# EAGLE design HM-MYS_relay_board_v1.0 (EAGLE 6.6.0)
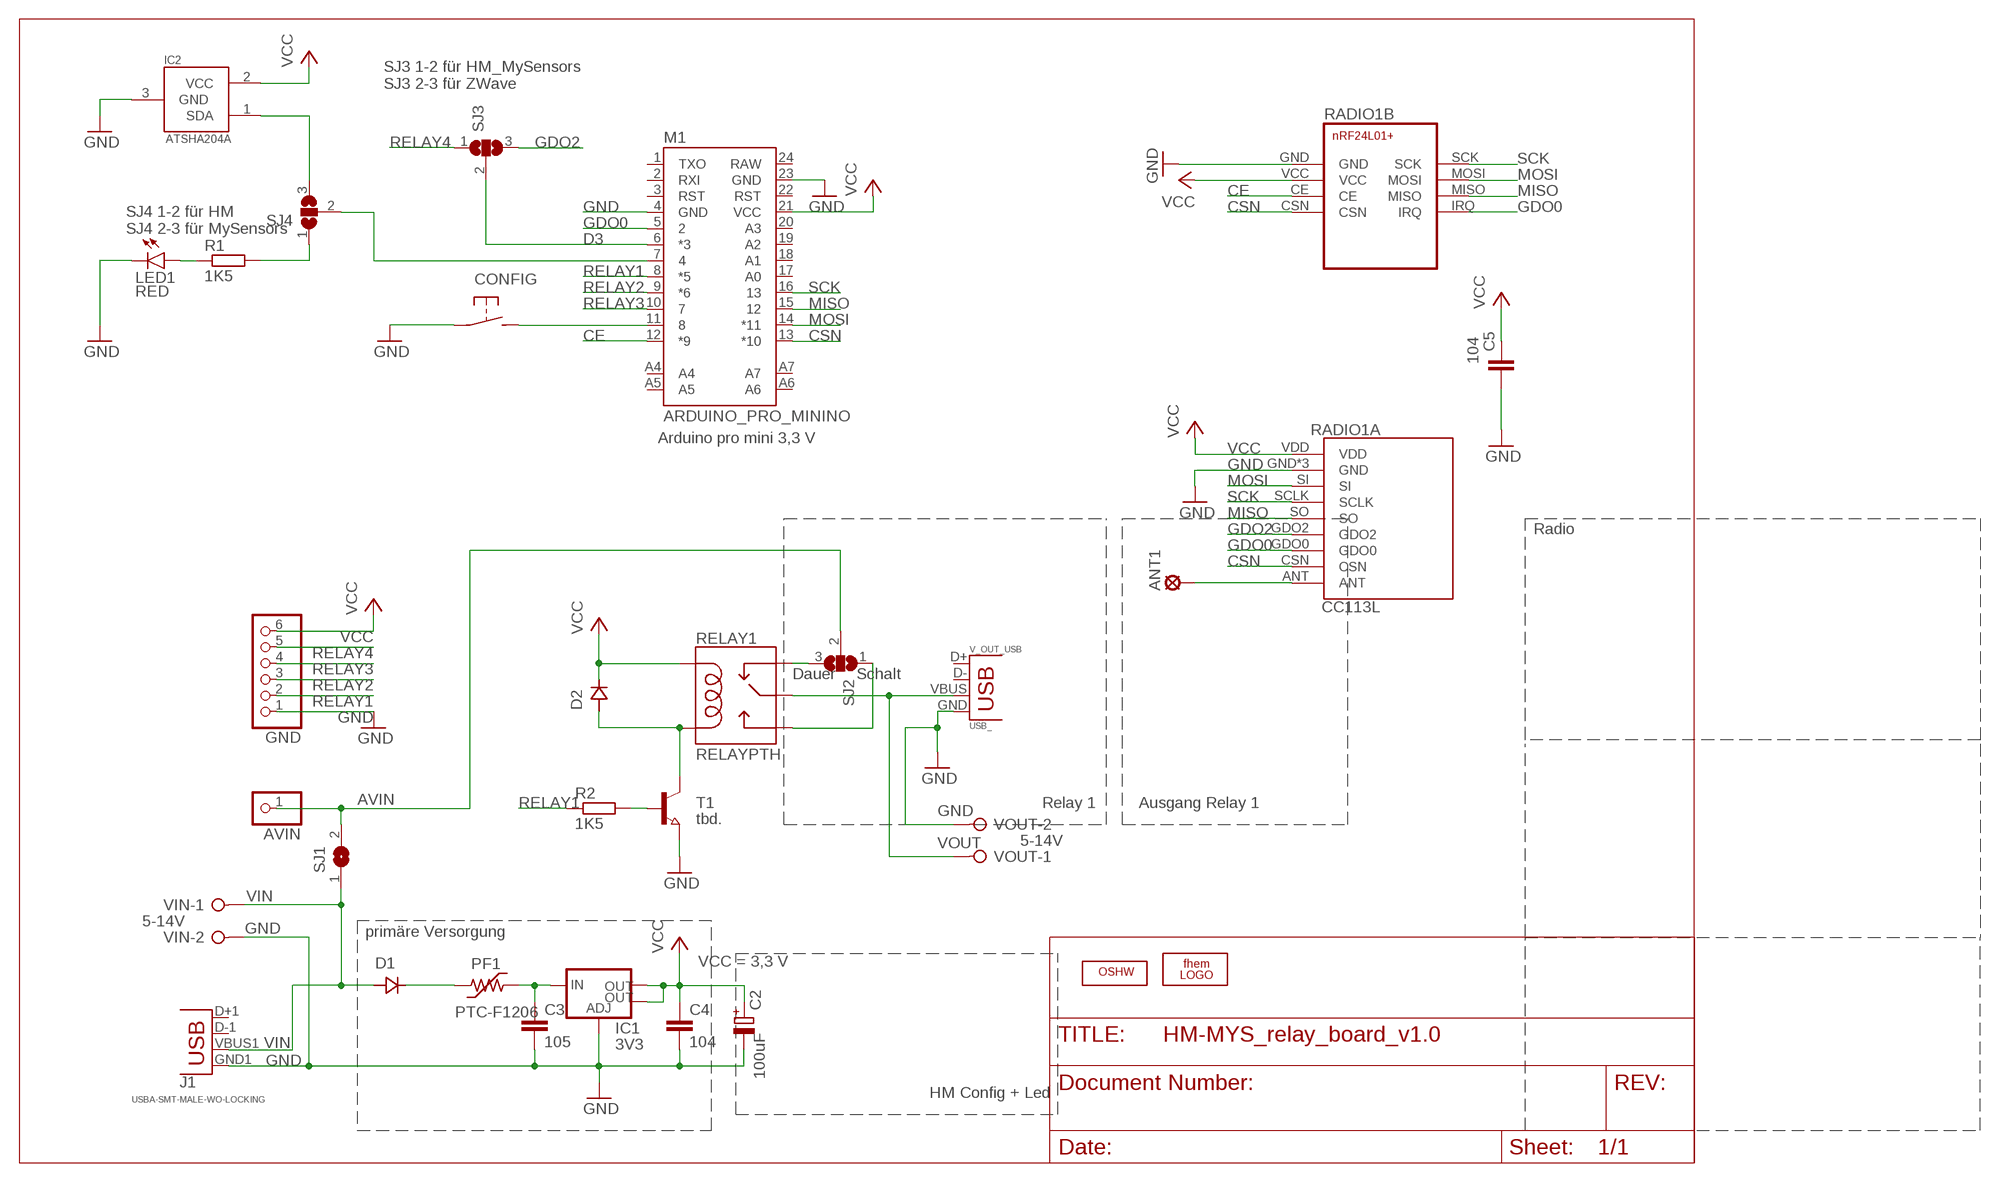
[diagram p0: schematic, sheet 1]

## Parts
ANT1  LSP10  [LSP10]
AVIN  PINHD-1X1  [1X01]
C2  100uF  CPOL-EUE2,5-6E  [E2,5-6E]
C3  105  C-EUC0805  [C0805]
C4  104  C-EUC0805  [C0805]
C5  104  C-EUC0805  [C0805]
CONFIG  TASTERSMD  [TASTER-SMD]
D1  SS14  [DO214]
D2  SS14  [DO214]
GND  PINHD-1X6_S  [1X06]
IC1  3V3  V_REG_LM1117SOT223  [SOT223]
IC2  ATSHA204A  IC_ATSHA204A_CRYPT  [SOT23-3]
J1  USBA-SMT-MALE-WO-LOCKING  [USB-A-SMT-MALE-NO_LOCKING]
LED1  RED  LED-RED1206  [LED-1206]
LOGO2  LOGO_OSHWX0070  [OSHW_6X70]
M1  ARDUINO_PRO_MININO  [ARDUINO_PRO_MINI_O]
PF1  PTC-F1206  [F1206]
R1  1K5  R0805_SMALL_GAP  [R0805_SMALL_GAP]
R2  1K5  R0805_SMALL_GAP  [R0805_SMALL_GAP]
RADIO1A  CC113L  [CC113L]
RADIO1B  NRF24L01+NRF24L01+MINI  [NRF24L01+MINI]
RELAY1  RELAYPTH  [SRD-05VDC-SL-C]
SJ1  SJ  [SJ]
SJ2  SJ2W  [SJ_2]
SJ3  SJ2W  [SJ_2]
SJ4  SJ2W  [SJ_2]
T1  tbd.  NPN-TRANSISTOR_SOT89  [SOT89]
U$2  LOGO_FHEMSTOP  [LOGO_FHEM_3X3_STOP]
V_OUT_USB  USB_  [USB-A-S-SILK-FEMALE]
VIN  W237-02P  [W237-132]
VOUT  W237-02P  [W237-132]

## Nets
ATSHA: IC2.1(SDA) SJ4.3
AVIN: AVIN.1 SJ1.2 SJ2.2
CE: M1.12(*9) RADIO1B.CE
CSN: M1.13(*10) RADIO1A.CSN RADIO1B.CSN
D3: M1.6(*3) SJ3.2
D4: M1.7 SJ4.2
DAUER: RELAY1.SWCLOSED(SWCLOSE) SJ2.3
GDO0: M1.5 RADIO1A.GDO0 RADIO1B.IRQ
GDO2: RADIO1A.GDO2 SJ3.3
GND: C2.- C3.2 C4.2 C5.2 CONFIG.1(P) GND.1 IC1.1(ADJ) IC2.3(GND) J1.GND1(GND) LED1.C M1.4(GND) M1.23(GND) RADIO1A.GND RADIO1A.GND1(GND) RADIO1A.GND2(GND) RADIO1B.GND T1.3(E) V_OUT_USB.GND VIN.2 VOUT.2
LED: R1.2 SJ4.1
MISO: M1.15 RADIO1A.SO RADIO1B.MISO
MOSI: M1.14(*11) RADIO1A.SI RADIO1B.MOSI
N$1: CONFIG.2(S) M1.11
N$3: LED1.A R1.1
N$11: ANT1.1(MP) RADIO1A.ANT
N$13: D2.ANODE RELAY1.COIL0 T1.2(C)
N$16: R2.2 T1.1(B)
RELAY1: GND.2 M1.8(*5) R2.1
RELAY2: GND.3 M1.9(*6)
RELAY3: GND.4 M1.10
RELAY4: GND.5 SJ3.1
SCHALT: RELAY1.SWOPEN SJ2.1
SCK: M1.16 RADIO1A.SCLK RADIO1B.SCK
VCC: C2.+ C4.1 C5.1 D2.CATHODE GND.6 IC1.2(OUT) IC1.4(OUT) IC2.2(VCC) M1.21(VCC) RADIO1A.VDD RADIO1B.VCC RELAY1.COIL1
VIN: D1.ANODE J1.VBUS1(VBUS) SJ1.1 VIN.1
VOUT: RELAY1.SWCOMMON V_OUT_USB.VBUS VOUT.1
VREG_IN: C3.1 IC1.3(IN) PF1.2
VUSB: D1.CATHODE PF1.1
Unconnected: J1.D+1(D+) J1.D-1(D-) M1.1(TXO) M1.2(RXI) M1.3(RST) M1.17(A0) M1.18(A1) M1.19(A2) M1.20(A3) M1.22(RST) M1.24(RAW) M1.A4 M1.A5 M1.A6 M1.A7 V_OUT_USB.D+ V_OUT_USB.D-

## Notes on the sheet
- SJ3 1-2 für HM_MySensors
  SJ3 2-3 für ZWave
- SJ4 1-2 für HM
  SJ4 2-3 für MySensors
- Arduino pro mini 3,3 V
- Radio
- Dauer | Schalt
- Relay 1 | Ausgang Relay 1
- 5-14V
- 5-14V
- primäre Versorgung
- VCC = 3,3 V
- HM Config + Led

## Library data of the parts
ANT1 = Hexenmeister:LSP10: SOLDER PAD drill 1.0 mm, distributor Buerklin, 12H555
AVIN = pinhead:PINHD-1X1: PIN HEADER
C2 = rcl:CPOL-EU: POLARIZED CAPACITOR, European symbol
C3-C5 = resistor:C-EU: CAPACITOR, European symbol
CONFIG = Damian:TASTER: Microtaster
D1 D2 = ihpcb-diode:SS14
GND = Hexenmeister:PINHD-1X6_S: PIN HEADER
IC1 = SparkFun-PowerIC:V_REG_LM1117: Voltage Regulator LM1117 Standard adjustable voltage regulator but in SMD form. Spark Fun Electronics SKU : COM-00595; PROD_ID: VREG-08170
IC2 = MySensors:IC_ATSHA204A_CRYPT
J1 V_OUT_USB = SparkFun-Connectors:USB: USB Connectors USB-B-PTH is fully proven SKU : PRT-00139/CONN-08278 USB-miniB is fully proven SKU : PRT-00587 USB-A-PCB is untested. USB-A-H is throughly reviewed, but untested. Spark Fun Electronics SKU : PRT-00437 USB-B-SMT is throughly reviewed, but untested. Needs silkscreen touching up. USB-A-S has not been used/tested USB-MB-H has not been used/tested USB-MICROB has been used. CONN-09505
LED1 = SparkFun-LED:LED-RED: Assorted Red LEDs LilyPad 1206- DIO-09912 1206- DIO-00809 0603- DIO-00819 "SMART" means more efficient and expensive; PROD_ID: DIO-09912
LOGO2 = mechanics:LOGO_OSHW: Open-Source-Hardware Logo
M1 = Hexenmeister:ARDUINO_PRO_MINI
PF1 = polyswitch:PTC-: POLYSWITCH Polyswitch Resetable Fuses
R1 R2 = Hexenmeister:R0805_SMALL_GAP: SMD Resistor (0805) mit einer schmalleren Lücke (kann als Lötjumper erwendet werden)
RADIO1A = Damian:CC113L: CC113L Value Line Receiver Module CC1101 replacement module Source: http://www.ti.com/product/cc113l
RADIO1B = my:NRF24L01+: nRF24L01+ Transceiver Module
RELAY1 = SRD-05VDC-SL-C:RELAY: SPDT relay (COM-00101)
SJ1 = jumper:SJ: SMD solder JUMPER
SJ2-SJ4 = jumper:SJ2W: SMD solder JUMPER
T1 = semicon-smd-ipc:NPN-TRANSISTOR_: NPN TRANSISTOR
U$2 = logo:LOGO_FHEM: fhem logo for PCB
VIN VOUT = Hexenmeister:W237-02P: WAGO SREW CLAMP; OC_FARNELL: unknown; OC_NEWARK: unknown

## Board
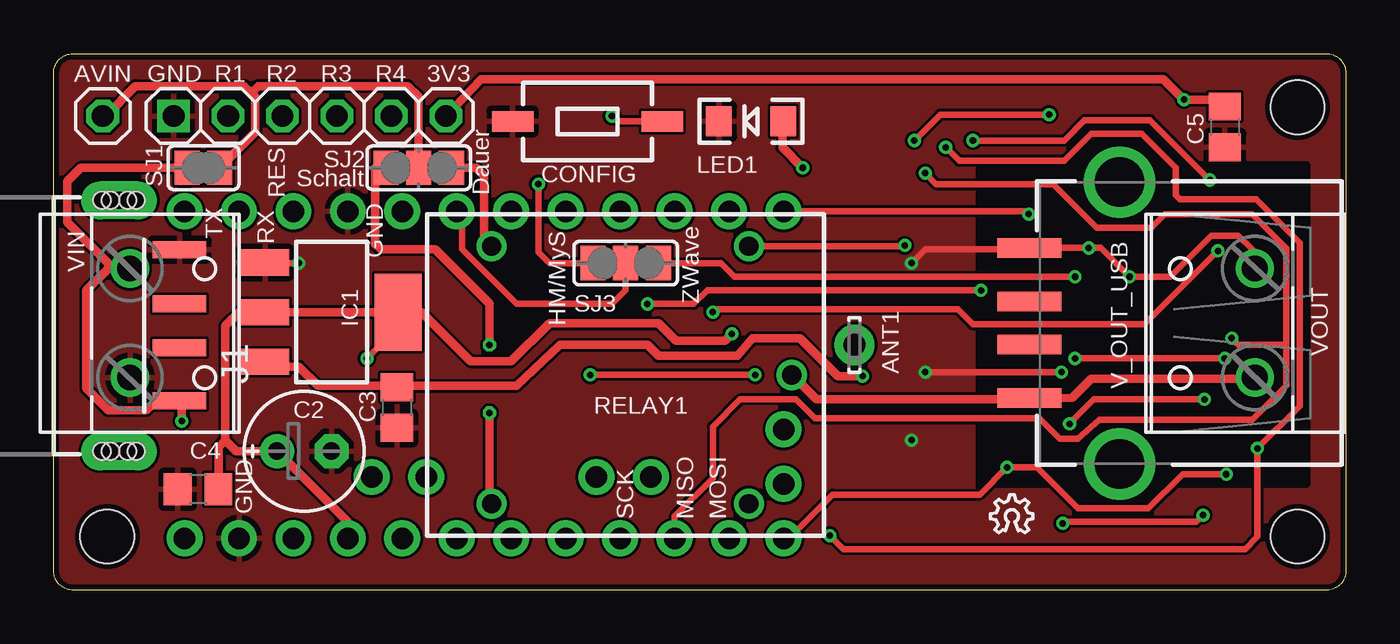
[diagram p1: board, top side]
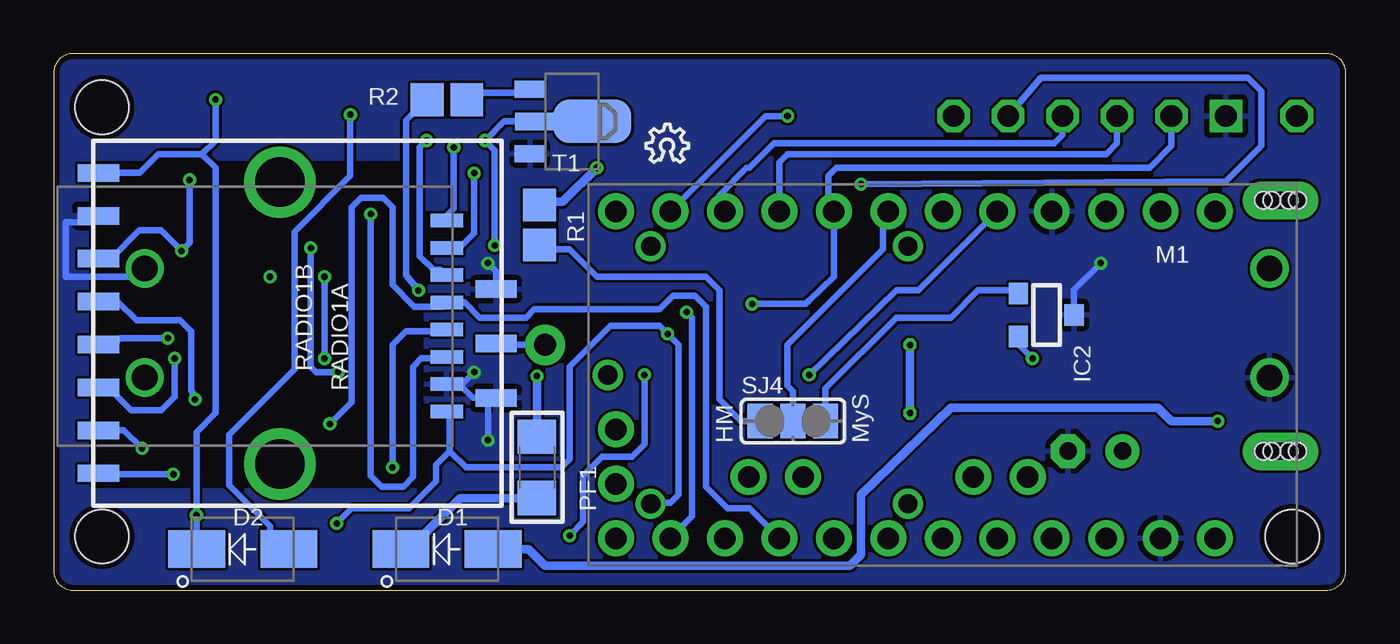
[diagram p2: board, bottom side, seen from below]

Size 60.26 x 25.01 mm. Coordinates in mm from the lower left corner, seen from the top.
Outline: 0.01,0.81 0.01,24.01 arc-90 0.81,25.01 59.26,25.01 arc-90 60.26,24.21 60.26,1.01 arc-90 59.46,0.01 1.01,0.01 arc-90 0.01,0.81
Copper layers (1*16): Top 0.035mm / dielectric 1.5mm / Bottom 0.035mm
Design rules "dirtypcbs_v1.0": minimum track width 5mil, minimum drill 12mil, track to track 5mil, track to pad 5mil, pad to pad 5mil, via to via 5mil, smd to smd 0mil, copper to edge 10mil, drill to drill 10mil, minimum pad ring 10mil, minimum via ring 6mil, stop-mask expansion 2mil, vias tented up to drill 25mil, thermal gap 10mil
Holes 2.5 mm at 2.51,2.51 58.01,2.51 58.01,22.51

### Footprints (pad centres in the part's own frame; a part is rotated, then mirrored left to right if it is on the bottom)
LSP10 = drill 1.016 pad 1.88: 1 0,0
1X01 = drill 1.016 octagon: 1 0,0
E2,5-6E = drill 0.813 pad 1.575: + -1.27,0 | drill 0.813 pad 1.575 octagon: - 1.27,0
C0805 = smd 1.3 x 1.5: 1 -0.95,0; 2 0.95,0
TASTER-SMD = smd 1.93 x 0.965: 1 -3.493,0; 2 3.493,0
DO214 = smd 2.65 x 1.75: ANODE -2.15,0; CATHODE 2.15,0
1X06 = drill 1.016 square: 1 -6.35,0 | drill 1.016 octagon: 2 -3.81,0; 3 -1.27,0; 4 1.27,0; 5 3.81,0; 6 6.35,0
SOT223 = smd 1.219 x 2.235: 1 -2.311,-3.099; 2 0,-3.099; 3 2.311,-3.099 | smd 3.6 x 2.2: 4 0,3.099
SOT23-3 = smd 1 x 0.9: 1 -1,-1.3; 2 1,-1.3; 3 0,1.3
USB-A-SMT-MALE-NO_LOCKING = smd 0.8 x 2.5: D+1 1.027,-5.87; D-1 -1.027,-5.87; GND1 3.551,-5.87; VBUS1 -3.5,-5.87 | drill 0.8 pad 1.778 long: P$1 5.85,-3.05; P$3 -5.85,-3.05 | hole 0.8: -5.85,-3.45; -5.85,-3.85; -5.85,-2.65; -5.85,-2.25; 5.85,-3.45; 5.85,-3.85; 5.85,-2.65; 5.85,-2.25
LED-1206 = smd 1.2 x 1.4: A -1.5,0; C 1.5,0
ARDUINO_PRO_MINI_O = drill 1 pad 1.676: 1 -7.62,12.7; 2 -7.62,10.16; 3 -7.62,7.62; 4 -7.62,5.08; 5 -7.62,2.54; 6 -7.62,0; 7 -7.62,-2.54; 8 -7.62,-5.08; 9 -7.62,-7.62; 10 -7.62,-10.16; 11 -7.62,-12.7; 12 -7.62,-15.24; 13 7.62,-15.24; 14 7.62,-12.7; 15 7.62,-10.16; 16 7.62,-7.62; 17 7.62,-5.08; 18 7.62,-2.54; 19 7.62,0; 20 7.62,2.54; 21 7.62,5.08; 22 7.62,7.62; 23 7.62,10.16; 24 7.62,12.7; A4 4.763,1.429; A5 4.763,3.969; A6 4.763,-9.049; A6@1 2.54,-15.24; A7 4.763,-6.509; A7@1 5.08,-15.24
F1206 = smd 1.6 x 1.803: 1 -1.429,0; 2 1.429,0
R0805_SMALL_GAP = smd 1.524 x 1.524: 1 -0.927,0; 2 0.927,0
CC113L = smd 0.813 x 1.93: ANT 0.953,9.271; CSN 7,-9.271; GDO0 5,-9.271; GDO2 3,-9.271; GND -5,-9.271; GND1 -1.587,9.271; GND2 3.493,9.271; SCLK -1,-9.271; SI -3,-9.271; SO 1,-9.271; VDD -7,-9.271
NRF24L01+MINI = smd 0.635 x 1.524: CE -1.575,-7.861; CSN -0.305,-7.861; GND -2.845,-7.861; IRQ 4.775,-7.861; MISO 3.505,-7.861; MOSI 2.235,-7.861; SCK 0.965,-7.861; VCC -4.115,-7.861
SRD-05VDC-SL-C = drill 0.9: COIL0 -5.39,-6.12; COIL1 -5.39,5.88; SWCLOSED 6.61,-6.12; SWCOMMON -7.39,-0.12; SWOPEN 6.61,5.88
SJ = smd 1.168 x 1.6: 1 -0.762,0; 2 0.762,0
SJ_2 = smd 1.168 x 1.6: 1 -1.524,0; 2 0,0; 3 1.524,0
SOT89 = smd 0.8 x 1.4: 1 -1.499,-1.981; 3 1.499,-1.981 | smd 0.8 x 1.9: 2 0,-1.727 | smd 2.032 x 3.65: 2@1 0,0.94
USB-A-S-SILK-FEMALE = smd 3 x 0.9: D+ 7.212,-1; D- 7.212,1; GND 7.212,-3.5; VBUS 7.212,3.5 | drill 2.311: P$5 3,-6.566; P$6 3,6.566
W237-132 = drill 1.194: 1 -2.54,-0.635; 2 2.54,-0.635

### Placement (x,y rotation side)
ANT1  37.34,11.44 90 top
AVIN  2.29,22.1 0 top
C2  11.69,6.48 0 top
C3  16.01,8.51 270 top
C4  6.74,4.7 180 top
C5  54.62,21.6 270 top
CONFIG  24.9,21.85 0 top
D1  41.92,1.91 180 bottom
D2  51.44,1.91 180 bottom
GND  11.94,22.1 0 top
IC1  12.96,12.96 270 top
IC2  13.98,12.83 270 bottom
J1  0.01,12.32 90 top
LED1  32.52,21.85 180 top
LOGO1  LOGO_OSHWX0070  [OSHW_6X70]  43.69,2.67 0 top
LOGO2  32.64,19.94 0 bottom
M1  18.8,10.04 270 bottom
PF1  37.72,5.72 90 bottom
R1  37.6,17.02 270 bottom
R2  41.92,22.87 0 bottom
RADIO1A  48.9,12.45 270 bottom
RADIO1B  49.79,12.45 90 bottom
RELAY1  27.03,9.91 180 top
SJ1  6.99,19.69 0 top
SJ2  17.02,19.69 0 top
SJ3  26.68,15.25 0 top
SJ4  25.79,7.88 0 bottom
T1  36.07,21.85 270 bottom
U$2  36.2,19.06 0 top
V_OUT_USB  52.71,12.45 180 top
VIN  4.2,12.45 270 top
VOUT  55.38,12.45 90 top

### Tracks (layer width: path | path; a pad name or v marks a point on that pad's centre or on a via)
ATSHA
  Bottom 0.305: SJ4.3 24.26,9.4 20.96,12.71 18.42,12.71 17.15,13.98 15.42,13.98 IC2.1
AVIN
  Top 0.406: AVIN.1 2.42,22.1 3.82,23.5 8.9,23.5 9.21,23.18 | 9.21,23.18 9.4,22.99 9.4,21.34 SJ1.2 | SJ2.2 17.02,22.99 16.52,23.5 9.53,23.5 9.21,23.18
CE  (via drill 0.3)
  Top 0.305: v45.47,17.53 45.34,17.66 M1.12
  Bottom 0.305: RADIO1B.CE 42.23,10.8 43.12,10.8 43.5,10.42 43.5,5.28 43.95,4.83 44.96,4.83 45.47,5.34 v45.47,17.53
CSN  (via drill 0.3)
  Top 0.305: v54.68,5.4 52.65,5.4 51.06,3.82 47.76,3.82 45.85,5.72 v44.46,5.72 43.19,4.45 36.33,4.45 34.3,2.42 M1.13
  Bottom 0.305: v44.46,5.72 44.46,11.44 43.82,12.07 42.23,12.07 RADIO1B.CSN | v54.68,5.4 58.11,5.4 RADIO1A.CSN
D3
  Top 0.305: SJ3.2 26.68,13.98 26.04,13.34 21.6,13.34 19.06,15.88 19.06,17.4 M1.6
D4
  Bottom 0.305: SJ4.2 25.79,9.28 26.04,9.53 26.04,11.44 21.6,15.88 21.6,17.4 M1.7
DAUER
  Top 0.406: SJ2.3 19.69,19.69 20.07,19.31 20.07,16.52 20.07,16.38 RELAY1.SWCLOSED
GDO0  (via drill 0.3)
  Top 0.305: v41.6,20.64 42.23,20.01 47.12,20.01 48.39,21.28 50.74,21.28 52.33,19.69 52.33,18.42 52.52,18.23 56.08,18.23 58.11,16.2 58.11,8.58 v56.14,6.61 56.14,2.48 55.57,1.91 36.84,1.91 v36.2,2.55 | v32.71,10.04 v25.02,10.04
  Bottom 0.305: v41.6,20.64 41.6,17.79 41.92,17.47 RADIO1B.IRQ | 58.11,7.63 RADIO1A.GDO0 56.98,7.45 v56.14,6.61 | v32.71,10.04 32.71,6.8 33.28,6.23 34.68,6.23 35.57,5.34 35.57,3.18 v36.2,2.55 | v25.02,10.04 20.96,13.98 19.94,13.98 M1.5
GDO2  (via drill 0.3)
  Top 0.305: SJ3.3 31.12,15.25 31.76,14.61 v47.63,14.61 | v47.63,10.8 v54.62,10.8
  Bottom 0.305: v47.63,14.61 v47.63,10.8 | v54.62,10.8 54.62,9.02 55.25,8.39 56.65,8.39 57.79,9.53 57.46,9.53 RADIO1A.GDO2
GND  (via drill 0.3)
  Top 0.305: v11.44,15.25 9.89,15.25 IC1.1 | VOUT.2 55.89,15.12 55.89,15.88 55.25,16.52 53.98,16.52 52.08,14.61 v50.17,14.61 48.83,15.95 v48.27,15.95 V_OUT_USB.GND 45.43,15.88 40.65,15.88 v40.01,15.25 | v40.65,10.17 v47,10.17
  Bottom 0.305: IC2.3 12.68,14.01 v11.44,15.25 | 41.28,9.53 40.71,8.96 RADIO1A.GND2 40.01,8.58 v40.01,6.99 | 41.28,9.53 41.85,9.53 RADIO1B.GND | VOUT.2 56.14,14.99 56.52,14.61 59.7,14.61 59.7,17.15 58.47,17.15 RADIO1A.GND | RADIO1A.GND1 39.63,14.86 v40.01,15.25 | 41.28,9.53 v40.65,10.17 | v47,10.17 48.01,10.17 48.27,10.42 v48.27,15.95
  pour Bottom: 0.01,0.01 0.01,25.02 60.33,25.02 60.33,0.01
  pour Top: 0.01,0.01 0.01,25.02 60.33,25.02 60.33,0.01
  cutout Top: 58.43,19.82 43.19,19.82 43.19,4.96 58.43,4.96
  cutout Bottom: 58.43,19.82 43.19,19.82 43.19,4.96 58.43,4.96
LED
  Bottom 0.305: SJ4.1 28.2,7.88 29.22,8.9 29.22,13.98 29.85,14.61 34.93,14.61 36.2,15.88 37.38,15.88 R1.2
MISO  (via drill 0.3)
  Top 0.305: 57.47,11.44 57.47,15.94 55.89,17.53 51.82,17.53 51.19,16.9 48.65,16.9 46.61,18.93 41.15,18.93 v40.65,19.44 | 57.47,11.44 55.25,11.44 v54.93,11.75 | 57.47,11.44 57.47,9.53 55.89,7.94 48.77,7.94 47.76,7.05 46.93,7.05 45.98,8.01 35.5,8.01 34.61,8.9 32.01,8.9 30.74,7.63 30.74,5.21 28.96,3.43 M1.15
  Bottom 0.305: v54.93,11.75 57.16,11.75 57.47,11.44 58.11,11.44 RADIO1A.SO | RADIO1B.MISO 41.33,15.96 40.65,16.64 v40.65,19.44
MOSI  (via drill 0.3)
  Top 0.305: v42.87,20.96 47.12,20.96 48.07,21.91 51.12,21.91 v53.92,19.12 | v54.3,15.82 50.87,12.39 43.25,12.39 42.87,12.39 42.17,13.09 30.87,13.09 v30.74,12.96
  Bottom 0.305: v42.87,20.96 43.19,20.64 43.19,15.56 42.55,14.93 42.23,14.93 RADIO1B.MOSI | 30.74,3.18 31.12,2.8 | 31.12,2.8 M1.14 | v53.92,19.12 53.92,16.2 v54.3,15.82 55.25,16.77 56.27,16.77 57.58,15.45 RADIO1A.SI | v30.74,12.96 30.49,12.71 30.49,3.69 30.49,3.43 31.12,2.8
N$1  (via drill 0.3)
  Top 0.305: CONFIG.2 26.29,21.85 v26.04,22.1
  Bottom 0.305: v26.04,22.1 27.06,22.1 M1.11
N$3  (via drill 0.3)
  Top 0.305: 33.98,21.6 LED1.A
  Top 0.406: 33.98,21.6 33.98,20.64 v34.93,19.69
  Bottom 0.305: 37.47,18.1 R1.1
  Bottom 0.406: 37.47,18.1 36.52,18.1 v34.93,19.69
N$11
  Bottom 0.305: ANT1.1 39.38,11.44 RADIO1A.ANT
N$13  (via drill 0.3)
  Top 0.305: RELAY1.COIL0 39.65,16.03 v39.69,16.07 | v46.42,22.17 41.34,22.17 v40.14,20.96
  Bottom 0.305: v46.42,22.17 46.42,19.31 49.03,16.71 49.03,10.29 52.08,7.24 52.08,4.89 50.17,2.99 50.17,1.91 D2.ANODE | T1.2 39.25,21.85 v40.14,20.96 39.69,20.52 v39.69,16.07
N$16
  Bottom 0.305: T1.1 38.11,23.18 40.96,23.18 40.96,22.87 R2.2
RELAY1  (via drill 0.3)
  Top 0.305: v43.25,13.98 30.49,13.98 29.85,13.34 v27.69,13.34
  Bottom 0.305: v43.25,13.98 43.82,14.67 43.82,21.91 42.87,22.87 R2.1 | GND.2 8.13,20.71 9.15,19.69 23.75,19.69 24.14,19.31 24.14,17.79 M1.8 23.88,14.61 25.05,13.49 25.2,13.34 v27.69,13.34
RELAY2
  Bottom 0.305: M1.9 26.42,19.94 26.04,20.33 11.18,20.33 10.67,20.83 GND.3
RELAY3
  Bottom 0.305: GND.4 13.21,21.21 13.59,20.83 26.68,20.83 27.82,19.69 27.95,19.69 29.22,18.42 29.22,17.79 M1.10
RELAY4  (via drill 0.3)
  Top 0.305: SJ3.1 23.12,15.25 22.61,15.75 v22.61,18.93
  Bottom 0.305: v22.61,18.93 5.59,19.06 3.94,20.71 3.94,23.25 4.58,23.88 14.23,23.88 GND.5
SCHALT  (via drill 0.3)
  Top 0.406: v20.33,11.44 20.33,13.34 17.79,15.88 15.25,15.88 14.99,16.13 14.99,19.69 SJ2.1 | v20.33,8.26 20.33,4.13 RELAY1.SWOPEN
  Bottom 0.406: v20.33,8.26 v20.33,11.44
SCK  (via drill 0.3)
  Top 0.305: v53.66,8.9 48.52,8.9 v47.38,7.75
  Bottom 0.305: v53.66,8.9 53.85,9.34 53.85,12.07 54.36,12.58 56.39,12.58 57.27,13.45 RADIO1A.SCLK | v47.38,7.75 46.36,8.77 46.36,17.85 45.92,18.29 44.9,18.29 44.46,17.85 44.46,14.23 43.44,13.21 42.13,13.21 RADIO1B.SCK 41.1,13.42 40.39,12.71 38.23,12.71 37.85,13.09 32.01,13.09 31.37,13.72 30.36,13.72 29.85,13.21 29.85,4.83 28.83,3.82 27.82,3.82 M1.16
VCC  (via drill 0.3)
  Top 0.305: v47.06,3.12 47.12,3.18 53.28,3.18 v53.6,3.5 | v14.61,10.8 15.88,12.07 15.88,12.78 IC1.4
  Top 0.406: v31.63,11.94 31.31,11.63 29.03,11.63 28.2,12.45 23.12,12.45 21.34,10.67 19.44,10.67 17.15,12.96 IC1.4 IC1.2 8.64,12.96 8.01,12.32 8.01,6.99 | GND.6 19.94,23.82 51.76,23.82 v52.71,22.87 54.62,22.87 C5.1 | 8.01,6.99 7.69,6.67 C4.1 | 8.01,6.99 8.51,6.48 C2.+ 13.72,3.18 M1.21
  Bottom 0.305: 41.92,8.26 RADIO1B.VCC 41.79,8.2 41.79,6.48 | 53.35,20.33 52.71,19.69 52.71,8.26 53.6,7.37 v53.6,3.5 D2.CATHODE | 53.35,20.33 55.38,20.33 56.25,19.45 RADIO1A.VDD | RELAY1.COIL1 31.63,4.07 31.5,4.07 31.12,4.45 31.12,11.44 v31.63,11.94 32.01,12.32 34.3,12.32 36.2,10.42 36.2,6.1 36.58,5.72 41.03,5.72 41.79,6.48 | 41.79,6.48 42.42,5.85 42.42,5.09 43.69,3.82 46.36,3.82 v47.06,3.12 | v52.71,22.87 52.71,20.96 53.35,20.33 | IC2.2 15.28,11.47 v14.61,10.8
VIN  (via drill 0.3)
  Top 0.406: VIN.1 2.55,14.99 | 2.55,14.99 1.53,13.98 1.53,9.4 2.55,8.39 4.32,8.39 4.76,8.82 J1.VBUS1 5.97,8.82 v5.97,7.88 | SJ1.1 1.28,19.69 0.64,19.06 0.64,17.15 2.55,15.25 2.55,14.99
  Bottom 0.406: v5.97,7.88 8.13,7.88 8.77,8.51 18.04,8.51 18.42,8.51 22.61,4.45 22.61,1.66 23.12,1.15 37.34,1.15 38.11,1.91 D1.ANODE
VOUT
  Top 0.305: 45.41,8.9 V_OUT_USB.VBUS
  Top 0.406: 45.41,8.9 35.57,8.9 34.61,9.85 RELAY1.SWCOMMON | VOUT.1 55.89,9.85 48.39,9.85 47.5,8.96 V_OUT_USB.VBUS
VREG_IN  (via drill 0.3)
  Top 0.305: 15.88,9.53 C3.1 16.2,9.53
  Top 0.406: 15.88,9.53 12.32,9.53 11.44,10.42 10.09,10.42 IC1.3 | 16.2,9.53 21.6,9.53 23.63,11.44 27.69,11.44 28.2,10.93 31.88,10.93 32.58,11.75 34.8,11.75 36.58,9.98 v37.72,9.98
  Bottom 0.305: 37.72,7.24 37.79,7.31 PF1.2
  Bottom 0.406: v37.72,9.98 37.72,7.24
VUSB
  Bottom 0.406: PF1.1 41.31,4.29 43.69,1.91 D1.CATHODE

### Text on the board
tNames: R1 | R2 | R3 | R4 | 3V3 | Schalt | RES | Dauer | TX | RX | GND | ZWave | HM/MyS | GND | SCK | MISO | MOSI
bNames: MyS | HM
tStop: HM-MYS-RELAY v1.0
bStop: HM-MYS-RELAY v1.0